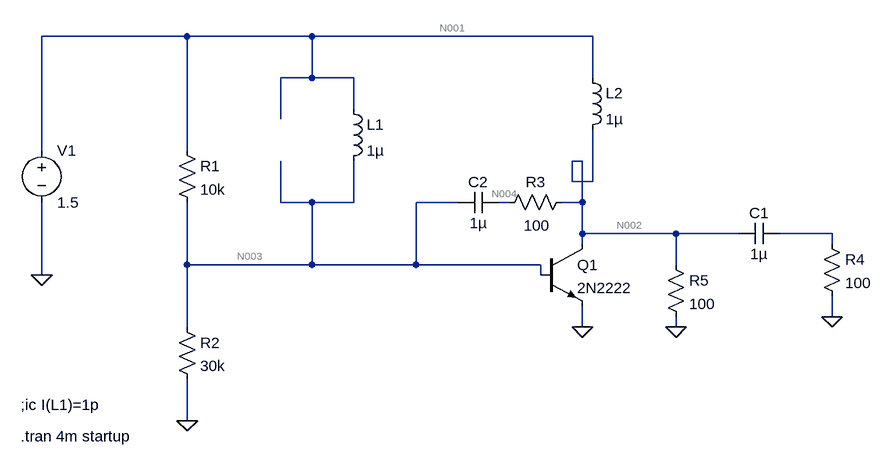
[diagram p0: schematic osc2.asc]
osc2.asc, the LTspice schematic file:
Version 4
SHEET 1 880 680
WIRE -432 -128 -656 -128
WIRE -240 -128 -432 -128
WIRE 192 -128 -240 -128
WIRE -240 -64 -240 -128
WIRE -240 -64 -288 -64
WIRE -176 -64 -240 -64
WIRE 192 -64 192 -128
WIRE -176 -16 -176 -64
WIRE -288 0 -288 -64
WIRE -656 48 -656 -128
WIRE -432 48 -432 -128
WIRE 176 64 160 64
WIRE 160 96 160 64
WIRE 192 96 192 16
WIRE 192 96 160 96
WIRE -288 128 -288 64
WIRE -240 128 -288 128
WIRE -176 128 -176 64
WIRE -176 128 -240 128
WIRE -16 128 -80 128
WIRE 64 128 48 128
WIRE 176 128 176 64
WIRE 176 128 144 128
WIRE 176 176 176 128
WIRE 320 176 176 176
WIRE 416 176 320 176
WIRE 560 176 480 176
WIRE 176 192 176 176
WIRE 560 192 560 176
WIRE -432 224 -432 128
WIRE -240 224 -240 128
WIRE -240 224 -432 224
WIRE -80 224 -80 128
WIRE -80 224 -240 224
WIRE 112 224 -80 224
WIRE 320 224 320 176
WIRE -656 240 -656 128
WIRE 112 240 112 224
WIRE 560 304 560 272
WIRE -432 320 -432 224
WIRE 176 320 176 288
WIRE 320 320 320 304
WIRE -432 464 -432 400
FLAG -656 240 0
FLAG -432 464 0
FLAG 560 304 0
FLAG 176 320 0
FLAG 320 320 0
SYMBOL npn 112 192 R0
SYMATTR InstName Q1
SYMATTR Value 2N2222
SYMBOL res -448 32 R0
SYMATTR InstName R1
SYMATTR Value 10k
SYMBOL res -448 304 R0
SYMATTR InstName R2
SYMATTR Value 30k
SYMBOL ind -192 -32 R0
SYMATTR InstName L1
SYMATTR Value 1µ
SYMBOL voltage -656 32 R0
WINDOW 123 0 0 Left 0
WINDOW 39 0 0 Left 0
SYMATTR InstName V1
SYMATTR Value 1.5
SYMBOL res 544 176 R0
SYMATTR InstName R4
SYMATTR Value 100
SYMBOL cap 480 160 R90
WINDOW 0 0 32 VBottom 2
WINDOW 3 32 32 VTop 2
SYMATTR InstName C1
SYMATTR Value 1µ
SYMBOL cap 48 112 R90
WINDOW 0 0 32 VBottom 2
WINDOW 3 32 32 VTop 2
SYMATTR InstName C2
SYMATTR Value 1µ
SYMBOL ind 176 -80 R0
SYMATTR InstName L2
SYMATTR Value 1µ
SYMBOL res 304 208 R0
SYMATTR InstName R5
SYMATTR Value 100
SYMBOL res 160 112 R90
WINDOW 0 0 56 VBottom 2
WINDOW 3 36 54 VTop 2
SYMATTR InstName R3
SYMATTR Value 100
TEXT -688 488 Left 2 !.tran 4m startup
TEXT -688 440 Left 2 !;ic I(L1)=1p

The netlist it stands for:
* osc2.asc
Q1 N002 N003 0 0 2N2222
R1 N001 N003 10k
R2 N003 0 30k
L1 N001 N003 1µ
V1 N001 0 1.5
R4 N005 0 100
C1 N005 N002 1µ
C2 N004 N003 1µ
L2 N001 N002 1µ
R5 N002 0 100
R3 N002 N004 100
.model NPN NPN
.model PNP PNP
.lib standard.bjt
.tran 4m startup
;ic I(L1)=1p
.backanno
.end

* Results of the author's LTspice run, read from the files saved beside the schematic
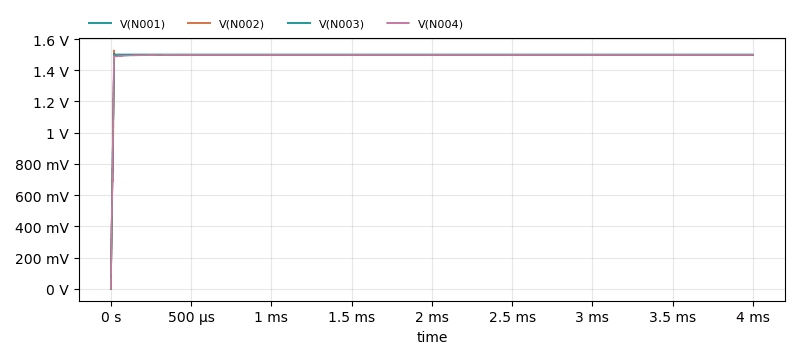
[diagram p1: Transient Analysis of osc2.asc, plotted from the saved traces]
* Transient Analysis, 1 run:
*   V(N001): min 0 V, max 1.5 V, average 1.496 V, rms 1.498 V, last 1.5 V
*   V(N002): min 0 V, max 1.528 V, average 1.495 V, rms 1.496 V, last 1.499 V
*   V(N003): min 0 V, max 1.504 V, average 1.496 V, rms 1.497 V, last 1.5 V
*   V(N004): min 0 V, max 1.499 V, average 1.495 V, rms 1.496 V, last 1.499 V